# Altium schematic sheet Guc.SchDoc
size A4
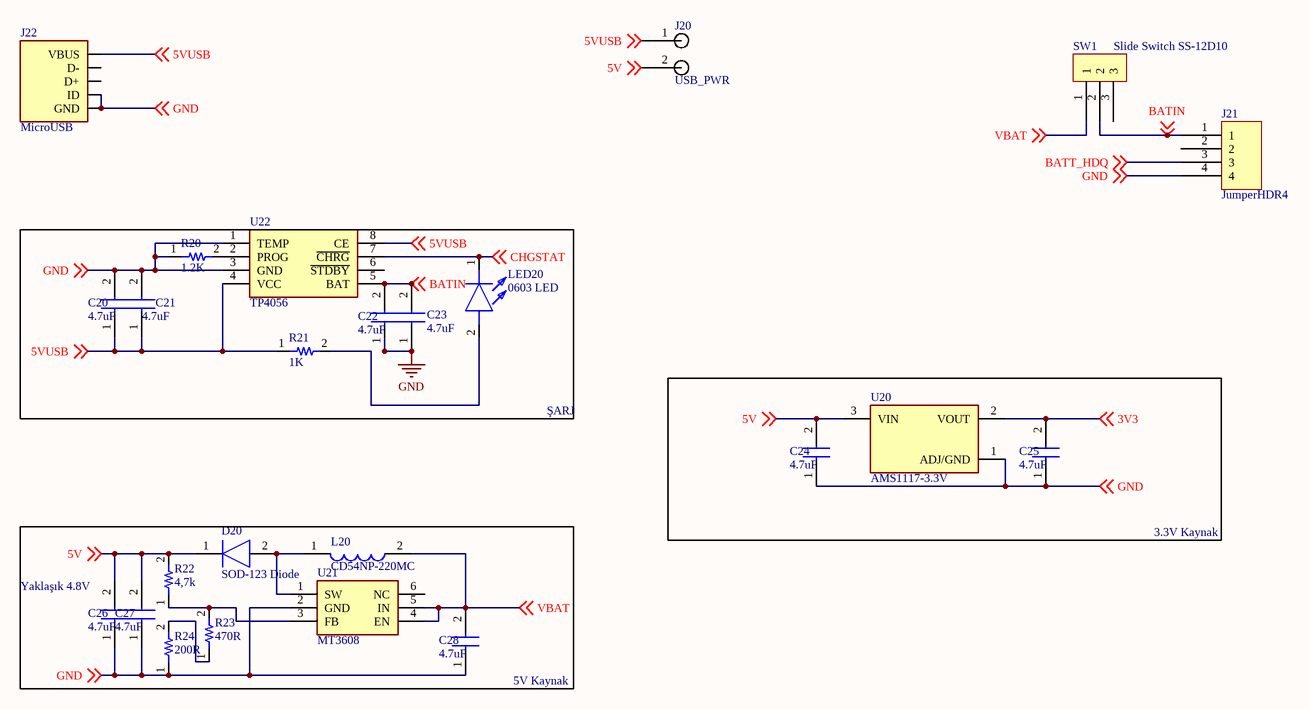
[diagram p0: Guc.SchDoc]

## Parts
C20  4.7uF  [0603 Capacitor]
C21  4.7uF  [0603 Capacitor]
C22  4.7uF  [0603 Capacitor]
C23  4.7uF  [0603 Capacitor]
C24  4.7uF  [0603 Capacitor]
C25  4.7uF  [0603 Capacitor]
C26  4.7uF  [0603 Capacitor]
C27  4.7uF  [0603 Capacitor]
C28  4.7uF  [0603 Capacitor]
D20  SOD-123 Diode  [SOD123]
J20  USB_PWR  [JumperHDR]
J21  JumperHDR4  [JumperHDR4]
J22  MicroUSB  [MicroUSB]
L20  CD54NP-220MC  [CD54NP220MC]
LED20  0603 LED  [0603 LED]
R20  1.2K  [0603 Resistor]
R21  1K  [0603 Resistor]
R22  4,7k  [0603 Resistor]
R23  470R  [0603 Resistor]
R24  200R  [0603 Resistor]
SW1  Slide Switch SS-12D10  [Slide Switch ss12d10]
U20  AMS1117-3.3V  [AMS1117_SOT223]
U21  MT3608  [MT3608]
U22  TP4056  [TP4056A]

## Blocks framed on the sheet
ŞARJ: C20-C23 LED20 R20 R21 U22
3.3V Kaynak: C24 C25 U20

## Nets
GND: C20.2 C21.2 C22.1 C23.1 C24.1 C25.1 C26.1 C27.1 C28.1 J21.4 J22.4(ID) J22.5(GND) R20.1 R24.1 U20.1(ADJ/GND) U21.2(GND) U22.1(TEMP) U22.3(GND) ; off-sheet GND
3V3: C25.2 U20.2(VOUT) ; off-sheet 3V3
5V: C24.2 C26.2 C27.2 D20.1(K) J20.2 R22.2 U20.3(VIN) ; off-sheet 5V
5VUSB: C20.1 C21.1 J20.1 J22.1(VBUS) R21.1 U22.4(VCC) U22.8(CE) ; off-sheet 5VUSB
BATIN: C22.2 C23.2 J21.1 SW1.2 U22.5(BAT) ; off-sheet BATIN
BATT_HDQ: J21.3 ; off-sheet BATT_HDQ
CHGSTAT: LED20.1(K) U22.7(~{CHRG}) ; off-sheet CHGSTAT
VBAT: C28.2 L20.2 SW1.1 U21.4(EN) U21.5(IN) ; off-sheet VBAT
NetD20_2: D20.2(A) L20.1 U21.1(SW)
NetLED20_2: LED20.2(A) R21.2
NetR20_2: R20.2 U22.2(PROG)
NetR22_1: R22.1 R23.2 U21.3(FB)
NetR23_1: R23.1 R24.2

Not connected (* = marked no-connect by the designer): J21 2; J22 2(D-) 3(D+); SW1 3; U21 6(NC); U22 6(~{STDBY})

## Notes on the sheet
- (near C26) Yaklaşık 4.8V
- 5V Kaynak

## Library data of the parts
C20-C28 = 0603 Capacitor: Capacitor; Manufacturer_Name: AVX; Manufacturer_Part_Number: 06031A120JAT2A; Datasheet Link: http://www.mouser.com/catalog/supplier/library/pdf/AVXSurfaceMountCeramic.pdf; Height: 0.9mm; Mouser Part Number: 581-06031A120J; Mouser Price/Stock: https://www.mouser.co.uk/ProductDetail/AVX/06031A120JAT2A?qs=tMrmimOZp5UsY%252BxF6dNGxQ%3D%3D; Arrow Part Number: 06031A120JAT2A; Arrow Price/Stock: https://www.arrow.com/en/products/06031a120jat2a/avx
D20 = SOD-123 Diode: Diode; Manufacturer_Name: Vishay; Manufacturer_Part_Number: 1N4148W-G3-08; Datasheet Link: https://componentsearchengine.com/Datasheets/1/1N4148W-G3-08.pdf; Height: 1.35mm; Mouser Part Number: 78-1N4148W-G3-08; Mouser Price/Stock: https://www.mouser.co.uk/ProductDetail/Vishay-Semiconductors/1N4148W-G3-08?qs=uS%252BVSIFnvp46StDBB15x4Q%3D%3D; Arrow Part Number: 1N4148W-G3-08; Arrow Price/Stock: https://www.arrow.com/en/products/1n4148w-g3-08/vishay
J20 = JumperHDR_ALT
J22 = MicroUSB: MP: ZX62-B-5PA; MF: Hirose; Value: *; Price: None; SnapEDA_Link: https://www.snapeda.com/parts/ZX62-B-5PA/Hirose%20Electric%20Co%20Ltd/view-part/134668/?ref=snap; Availability: Unavailable; Package: None
L20 = CD54NP-220MC: Inductor; Manufacturer_Name: Sumida; Datasheet Link: https://www.mouser.com/datasheet/2/390/CD54-465574.pdf; Height: 4.85mm; Manufacturer_Part_Number: CD54NP-220MC; Mouser Part Number: 851-CD54NP-220MC; Mouser Price/Stock: https://www.mouser.co.uk/ProductDetail/Sumida/CD54NP-220MC?qs=ttApTud31JaKcWkDFuIZsQ%3D%3D; Arrow Part Number: CD54NP-220MC; Arrow Price/Stock: https://www.arrow.com/en/products/cd54np-220mc/sumida
LED20 = 0603 LED: LED; Manufacturer_Name: Wurth Elektronik; Manufacturer_Part_Number: 150060GS55040; Datasheet Link: https://katalog.we-online.de/led/datasheet/150060GS55040.pdf; Height: 0.5mm; Mouser Part Number: 710-150060GS55040; Mouser Price/Stock: https://www.mouser.com/Search/Refine.aspx?Keyword=710-150060GS55040
R20-R24 = 0603 Resistor: Resistor; Manufacturer_Name: TE Connectivity; Manufacturer_Part_Number: CPF0603B100RE1; Datasheet Link: http://www.farnell.com/datasheets/1786775.pdf; Height: 0.55mm; Mouser Part Number: 279-CPF0603B100RE1; Mouser Price/Stock: https://www.mouser.co.uk/ProductDetail/TE-Connectivity-Neohm/CPF0603B100RE1?qs=DfH2yQaBz6s2KWheq2AlNw%3D%3D; Arrow Part Number: CPF0603B100RE1; Arrow Price/Stock: https://www.arrow.com/en/products/cpf0603b100re1/te-connectivity
U20 = AMS1117: MF: Seeed Technology; Availability: Unavailable; SnapEDA_Link: https://www.snapeda.com/parts/AMS1117/Seeed%20Technology%20Co.%2C%20Ltd/view-part/184428/?ref=snap; MP: AMS1117; Price: None; Value: *; Package: SOT-223 Seeed Technology
U21 = MT3608: Undefined or Miscellaneous; Manufacturer_Name: Aerosemi; Datasheet Link: https://www.olimex.com/Products/Breadboarding/BB-PWR-3608/resources/MT3608.pdf; Height: 1.45mm; Manufacturer_Part_Number: MT3608
U22 = TP4056: Connector; Manufacturer_Name: NanJing Top Power; Datasheet Link: https://dlnmh9ip6v2uc.cloudfront.net/datasheets/Prototyping/TP4056.pdf; Height: 1.75mm; Manufacturer_Part_Number: TP4056